# EAGLE design adapter_ADK (EAGLE 6.1)
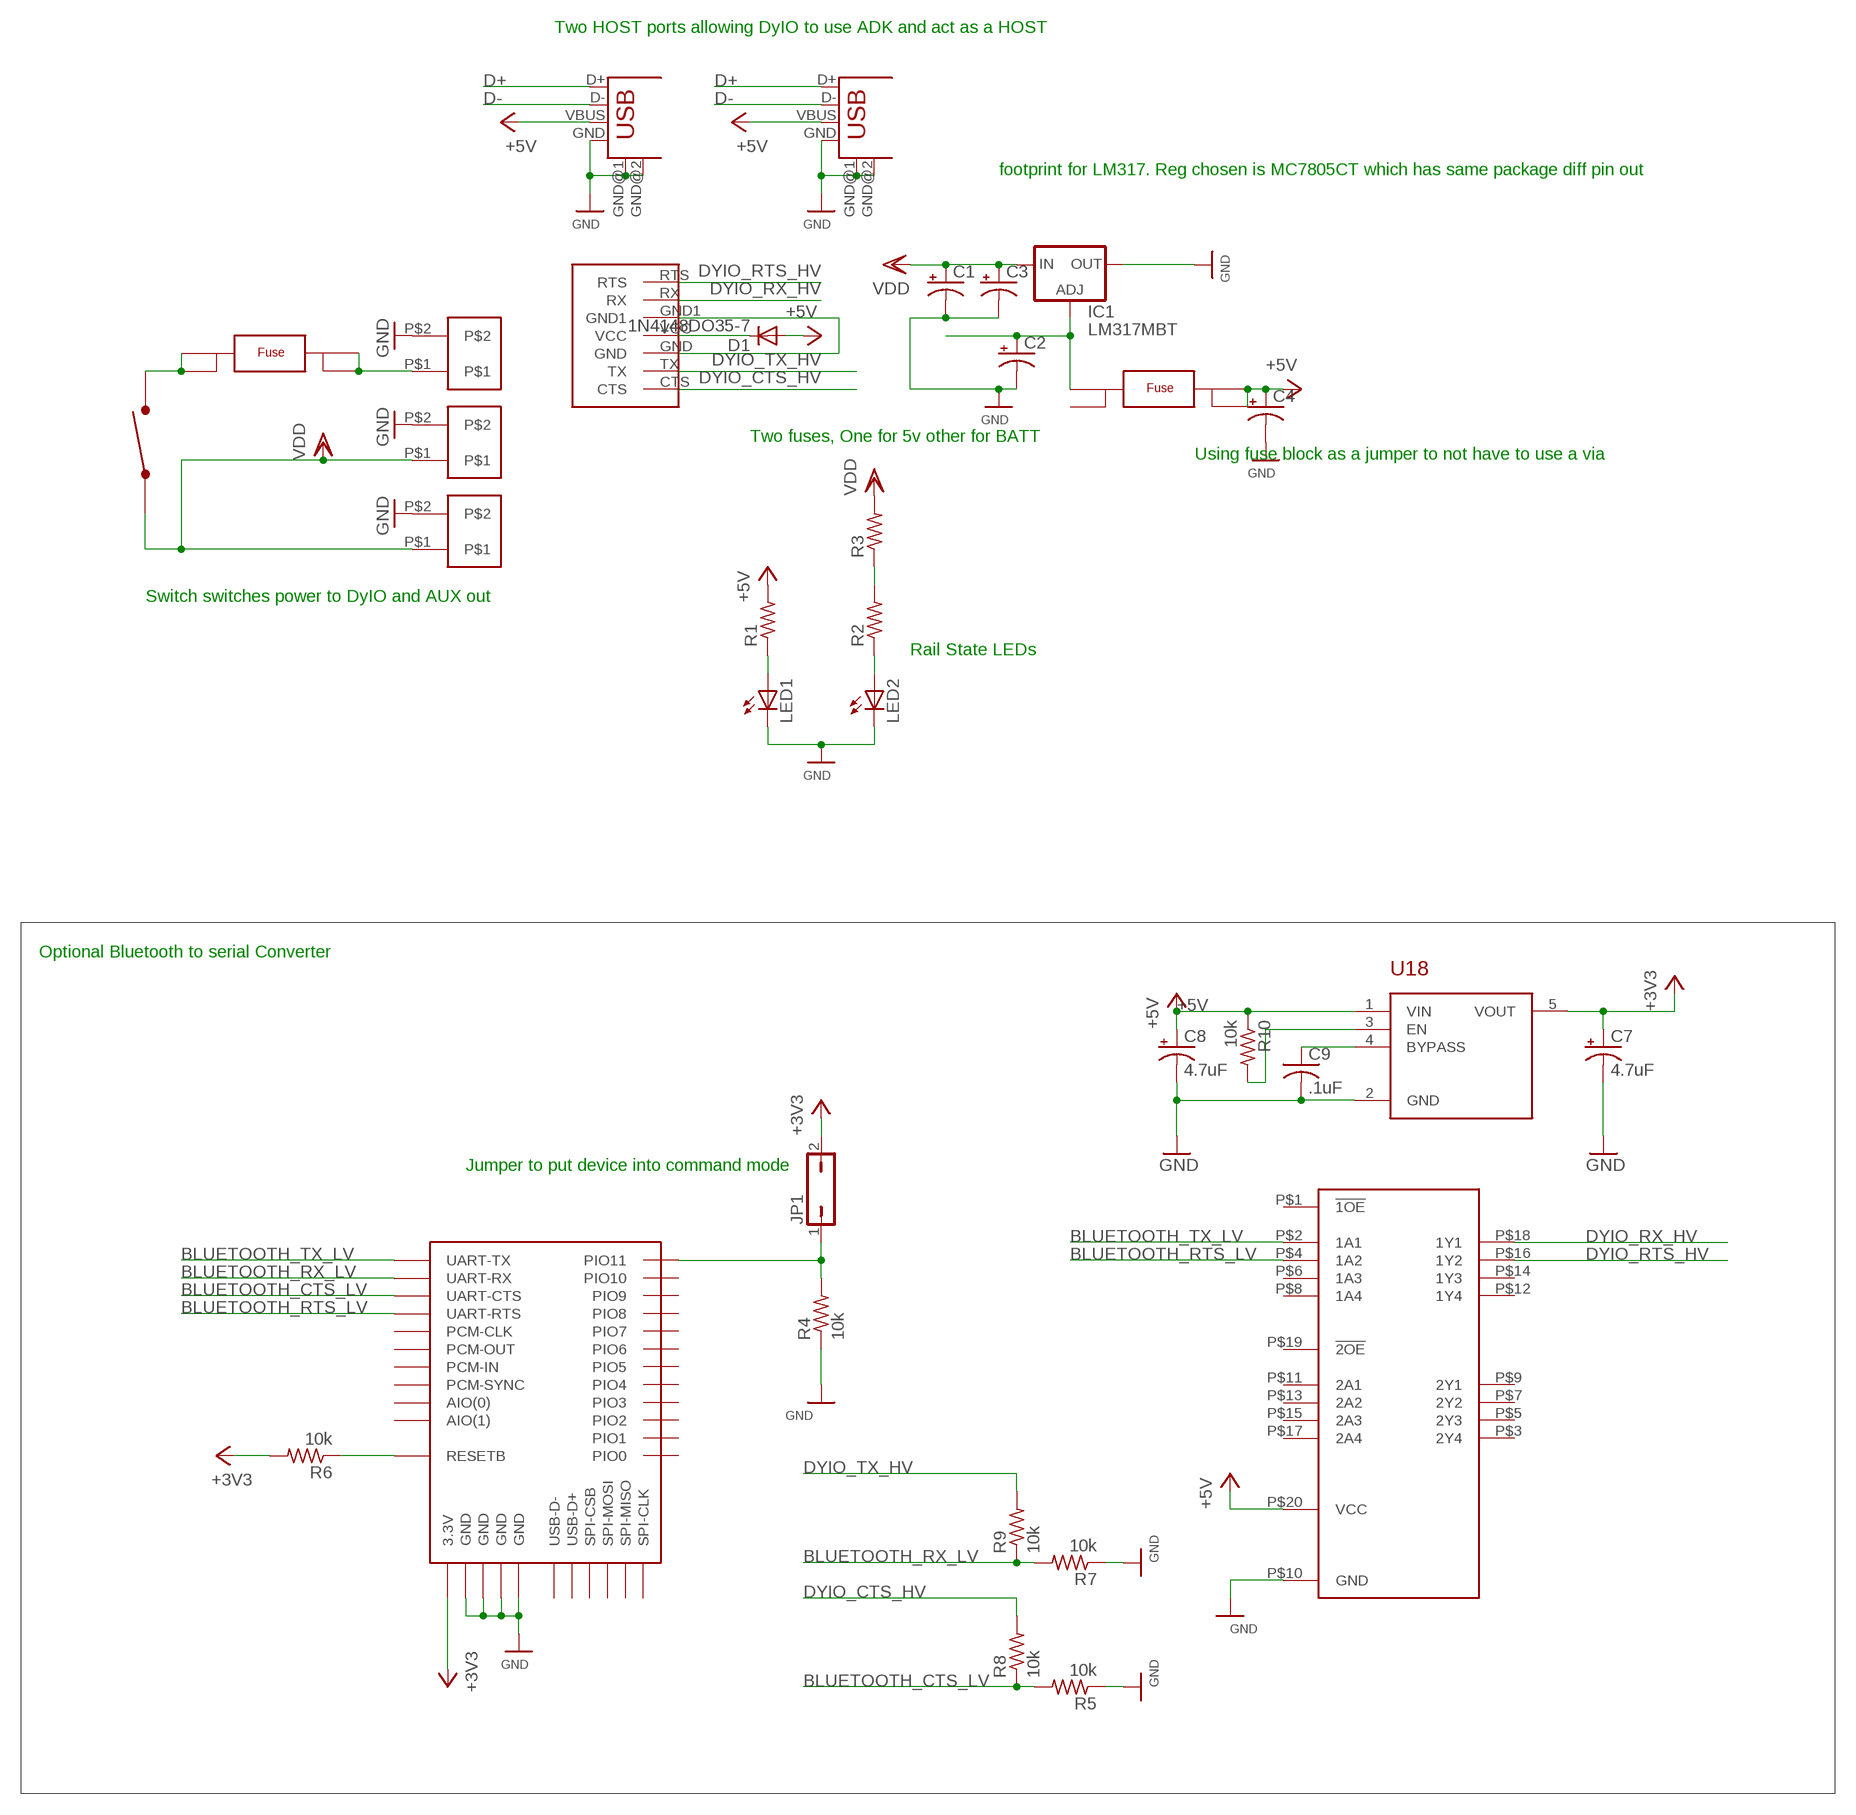
[diagram p0: schematic, sheet 1]

## Parts
C1  CPOL-USE2.5-5  [E2,5-5]
C2  CPOL-USE2.5-5  [E2,5-5]
C3  CPOL-USE2.5-5  [E2,5-5]
C4  CPOL-USE2.5-5  [E2,5-5]
C7  4.7uF  CPOL-USR/2012-12R  [R/2012-12R]
C8  4.7uF  CPOL-USR/2012-12R  [R/2012-12R]
C9  .1uF  C-USC0402  [C0402]
D1  1N4148DO35-7  [DO35-7]
IC1  LM317MBT  [TO220L1]
JP1  JP1Q  [JP1]
LED1  LED5MM  [LED5MM]
LED2  LED5MM  [LED5MM]
R1  R-US_0204/2V  [0204V]
R2  R-US_0204/2V  [0204V]
R3  R-US_0204/2V  [0204V]
R4  10k  R-US_R0603  [R0603]
R5  10k  R-US_R0603  [R0603]
R6  10k  R-US_R0603  [R0603]
R7  10k  R-US_R0603  [R0603]
R8  10k  R-US_R0603  [R0603]
R9  10k  R-US_R0603  [R0603]
R10  10k  R-US_R0402  [R0402]
U18  LDS3985XX33  [SOT23-5]
U$1  FUSE520  [FUSE-520]
U$2  FUSE520  [FUSE-520]
U$3  2P  [2PTH]
U$4  2P  [2PTH]
U$5  SPST  [SW331-ND]
U$6  BTM400_6B  [BTM400_6B]
U$7  SN74ACT24  [R-PDS0-G20]
U$10  WASP7PIN  [WASP7PIN]
U$19  2P  [2PTH]
USB1  USB-A-H  [USB-A-H]
USB2  USB-A-H  [USB-A-H]

## Nets
+3V3: C7.+ JP1.2 R6.2 U18.5(VOUT) U$6.3.3V
+5V: C4.+ C8.+ D1.A R1.2 R10.1 U18.1(VIN) U$2.F2A U$2.F2B U$7.P$20(VCC) USB1.VBUS USB2.VBUS
BLUETOOTH_CTS_LV: R5.2 R8.1 U$6.UART-CTS
BLUETOOTH_RTS_LV: U$6.UART-RTS U$7.P$4(1A2)
BLUETOOTH_RX_LV: R7.2 R9.1 U$6.UART-RX
BLUETOOTH_TX_LV: U$6.UART-TX U$7.P$2(1A1)
CFG: JP1.1 R4.2 U$6.PIO(11)(PIO11)
D+: USB1.D+ USB2.D+
D-: USB1.D- USB2.D-
DYIO_CTS_HV: R8.2 U$10.CTS
DYIO_RTS_HV: U$7.P$16(1Y2) U$10.RTS
DYIO_RX_HV: U$7.P$18(1Y1) U$10.RX
DYIO_TX_HV: R9.2 U$10.TX
GND: C1.- C2.- C3.- C4.- C7.- C8.- C9.2 IC1.2(OUT) LED1.K(C) LED2.K(C) R4.1 R5.1 R7.1 U18.2(GND) U$3.P$2 U$4.P$2 U$6.GND@1(GND) U$6.GND@2(GND) U$6.GND@3(GND) U$6.GND@4(GND) U$7.P$10(GND) U$10.GND U$10.GND1 U$19.P$2 USB1.GND USB1.GND@1(GND) USB1.GND@2(GND) USB2.GND USB2.GND@1(GND) USB2.GND@2(GND)
N$1: U$1.F1A U$1.F1B U$5.SW2
N$2: U$1.F2A U$1.F2B U$3.P$1
N$3: LED1.A R1.1
N$4: C2.+ IC1.1(ADJ) U$2.F1A
N$5: LED2.A R2.1
N$6: R2.2 R3.1
N$7: D1.C U$10.VCC
N$8: R6.1 U$6.RESETB
N$9: R10.2 U18.3(EN)
N$10: C9.1 U18.4(BYPASS)
VDD: C1.+ C3.+ IC1.3(IN) R3.2 U$4.P$1 U$5.SW1 U$19.P$1
Unconnected: U$2.F1B U$6.AIO(0) U$6.AIO(1) U$6.PCM-CLK U$6.PCM-IN U$6.PCM-OUT U$6.PCM-SYNC U$6.PIO(0)(PIO0) U$6.PIO(1)(PIO1) U$6.PIO(2)(PIO2) U$6.PIO(3)(PIO3) U$6.PIO(4)(PIO4) U$6.PIO(5)(PIO5) U$6.PIO(6)(PIO6) U$6.PIO(7)(PIO7) U$6.PIO(8)(PIO8) U$6.PIO(9)(PIO9) U$6.PIO(10)(PIO10) U$6.SPI-CLK U$6.SPI-CSB U$6.SPI-MISO U$6.SPI-MOSI U$6.USB-D+ U$6.USB-D- U$7.P$1(!1OE) U$7.P$3(2Y4) U$7.P$5(2Y3) U$7.P$6(1A3) U$7.P$7(2Y2) U$7.P$8(1A4) U$7.P$9(2Y1) U$7.P$11(2A1) U$7.P$12(1Y4) U$7.P$13(2A2) U$7.P$14(1Y3) U$7.P$15(2A3) U$7.P$17(2A4) U$7.P$19(!2OE)

## Notes on the sheet
- Two HOST ports allowing DyIO to use ADK and act as a HOST
- footprint for LM317. Reg chosen is MC7805CT which has same package diff pin out
- Two fuses, One for 5v other for BATT
- Using fuse block as a jumper to not have to use a via
- Switch switches power to DyIO and AUX out
- Rail State LEDs
- Optional Bluetooth to serial Converter
- Jumper to put device into command mode

## Library data of the parts
C1-C4 C7 C8 = rcl:CPOL-US: POLARIZED CAPACITOR, American symbol
C9 = rcl:C-US: CAPACITOR, American symbol
D1 = diode:1N4148: DIODE high speed (Philips)
IC1 = v-reg:LM317?*: 500 mA Adjustable Output Positive Voltage Regulator Source: http://www.onsemi.co.jp .. LM317M-D.PDF
JP1 = jumper:JP1Q: JUMPER
LED1 LED2 = led:LED: LED OSRAM: - CHIPLED LG R971, LG N971, LY N971, LG Q971, LY Q971, LO R971, LY R971 LH N974, LH R974 LS Q976, LO Q976, LY Q976 LO Q996 - Hyper CHIPLED LW Q18S LB Q993, LB Q99A, LB R99A - SideLED LS A670, LO A670, LY A670, LG A670, LP A670 LB A673, LV A673, LT A673, LW A673 LH A674 LY A675 LS A676, LA A676, LO A676, LY A676, LW A676 LS A679, LY A679, LG A679 - Hyper Micro SIDELED® LS Y876, LA Y876, LO Y876, LY Y876 LT Y87S - SmartLED LW L88C, LW L88S LB L89C, LB L89S, LG L890 LS L89K, LO L89K, LY L89K LS L896, LA L896, LO L896, LY L896 - TOPLED LS T670, LO T670, LY T670, LG T670, LP T670 LSG T670, LSP T670, LSY T670, LOP T670, LYG T670 LG T671, LOG T671, LSG T671 LB T673, LV T673, LT T673, LW T673 LH T674 LS T676, LA T676, LO T676, LY T676, LB T676, LH T676, LSB T676, LW T676 LB T67C, LV T67C, LT T67C, LS T67K, LO T67K, LY T67K, LW E67C LS E67B, LA E67B, LO E67B, LY E67B, LB E67C, LV E67C, LT E67C LW T67C LS T679, LY T679, LG T679 LS T770, LO T770, LY T770, LG T770, LP T770 LB T773, LV T773, LT T773, LW T773 LH T774 LS E675, LA E675, LY E675, LS T675 LS T776, LA T776, LO T776, LY T776, LB T776 LHGB T686 LT T68C, LB T68C - Hyper Mini TOPLED® LB M676 - Mini TOPLED Santana® LG M470 LS M47K, LO M47K, LY M47K Source: http://www.osram.convergy.de LUXEON: - LUMILED® LXK2-PW12-R00, LXK2-PW12-S00, LXK2-PW14-U00, LXK2-PW14-V00 LXK2-PM12-R00, LXK2-PM12-S00, LXK2-PM14-U00 LXK2-PE12-Q00, LXK2-PE12-R00, LXK2-PE12-S00, LXK2-PE14-T00, LXK2-PE14-U00 LXK2-PB12-K00, LXK2-PB12-L00, LXK2-PB12-M00, LXK2-PB14-N00, LXK2-PB14-P00, LXK2-PB14-Q00 LXK2-PR12-L00, LXK2-PR12-M00, LXK2-PR14-Q00, LXK2-PR14-R00 LXK2-PD12-Q00, LXK2-PD12-R00, LXK2-PD12-S00 LXK2-PH12-R00, LXK2-PH12-S00 LXK2-PL12-P00, LXK2-PL12-Q00, LXK2-PL12-R00 Source: www.luxeon.com KINGBRIGHT: KA-3528ASYC Source: www.kingbright.com
R1-R3 R10 = rcl:R-US_: RESISTOR, American symbol
R4-R9 = resistor:R-US_: RESISTOR, American symbol
U18 = LDS3985XX33:LDS3985XX33
U$1 U$2 = fuse:FUSE520
U$3 U$4 U$19 = con_2h_70555-0001:2P
U$5 = SW331-ND:SPST
U$6 = misc:BTM400_6B
U$7 = sn74act24:SN74ACT24
U$10 = wasp7pin:WASP7PIN
USB1 USB2 = con-usb-2:USB: USB Connectors

## Board
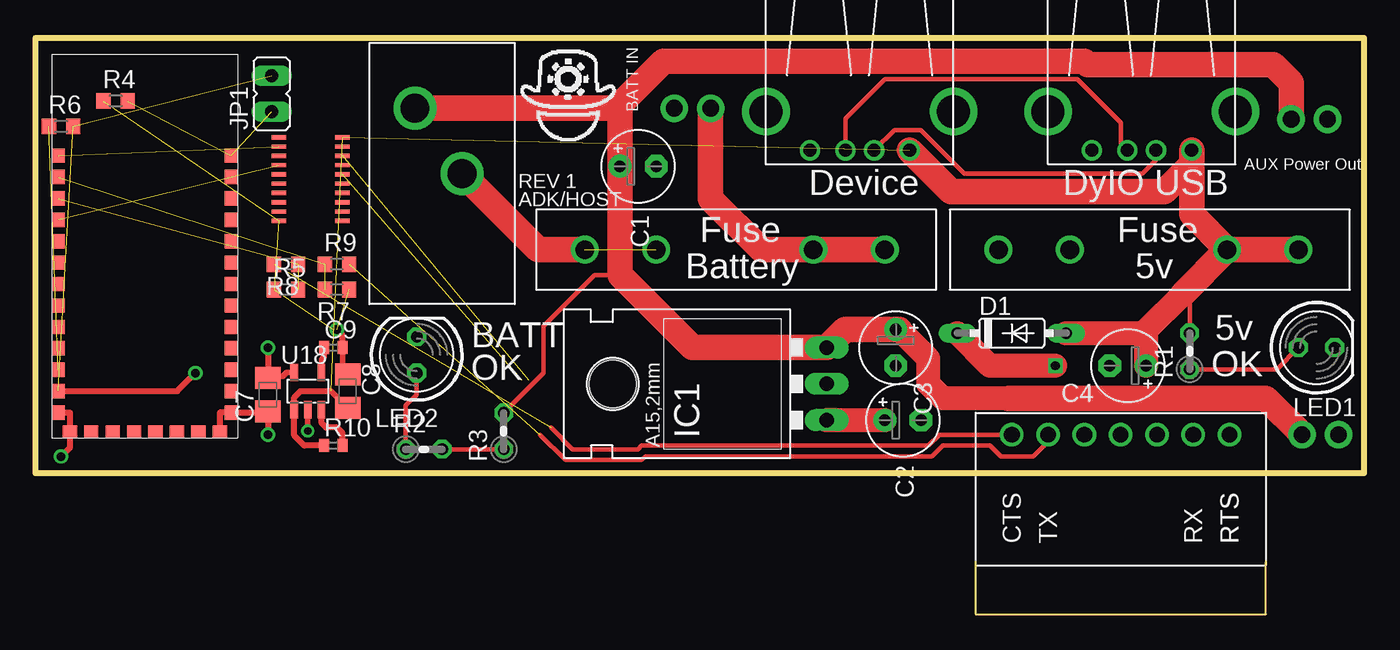
[diagram p1: board, top side]
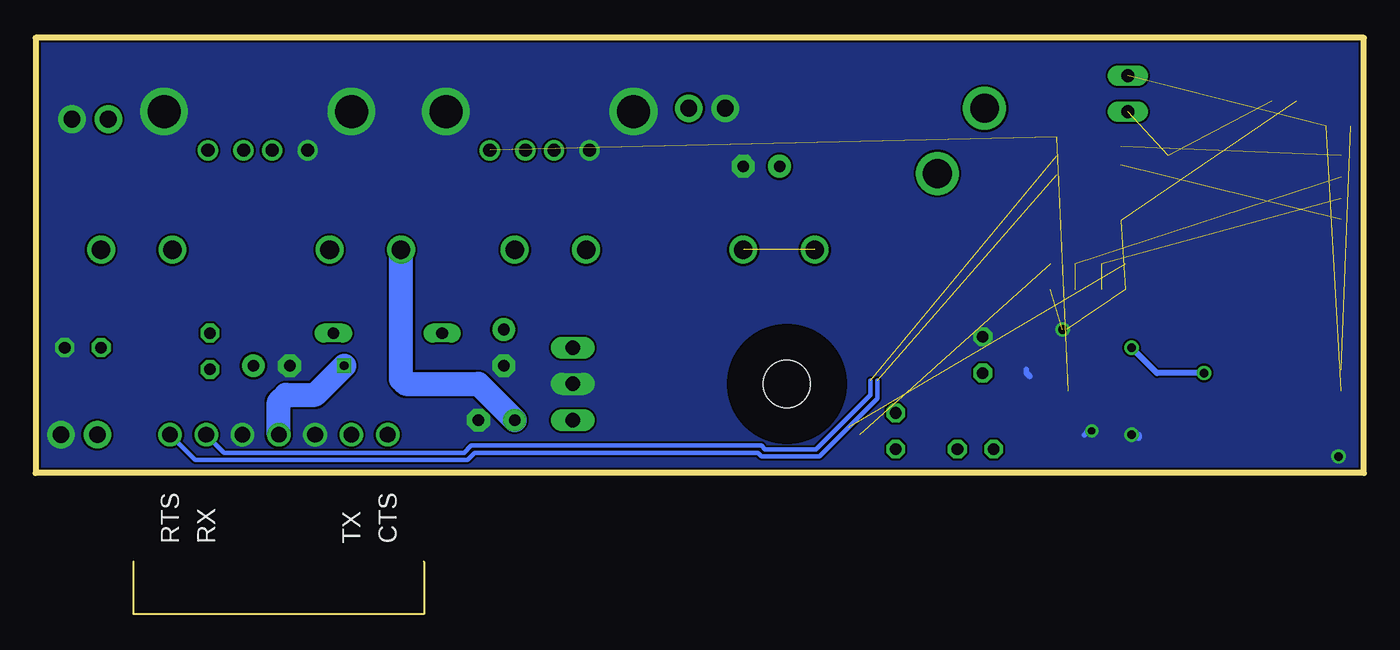
[diagram p2: board, bottom side, seen from below]

Size 92.96 x 30.48 mm. Coordinates in mm from the lower left corner, seen from the top.
Outline: 0,0 92.96,0 92.96,30.48 0,30.48 0,0
Copper layers (1*16): Top 0.035mm / dielectric 1.5mm / Bottom 0.035mm
Design rules: minimum track width 6mil, minimum drill 15mil, track to track 6mil, track to pad 6mil, pad to pad 6mil, via to via 6mil, smd to smd 6mil, copper to edge 6mil, drill to drill 6mil, minimum pad ring 10mil, minimum via ring 8mil, stop-mask expansion 4mil, vias tented up to drill 25mil, thermal gap 10mil

### Footprints (pad centres in the part's own frame; a part is rotated, then mirrored left to right if it is on the bottom)
E2,5-5 = drill 0.813 pad 1.6: + -1.27,0 | drill 0.813 pad 1.6 octagon: - 1.27,0
R/2012-12R = smd 1.55 x 1.8: + 1.175,0; - -1.175,0
C0402 = smd 0.7 x 0.9: 1 -0.65,0; 2 0.65,0
DO35-7 = drill 0.813 long: A 3.81,0; C -3.81,0
TO220L1 = drill 1.016 long: 1 -2.54,-3.81; 2 0,-3.81; 3 2.54,-3.81 | hole 3.302: 0,11.176
JP1 = drill 0.914 long: 1 0,-1.27; 2 0,1.27
LED5MM = drill 0.813 octagon: A -1.27,0; K 1.27,0
0204V = drill 0.813 octagon: 1 -1.27,0; 2 1.27,0
R0603 = smd 1 x 1.1: 1 -0.85,0; 2 0.85,0
R0402 = smd 0.7 x 0.9: 1 -0.65,0; 2 0.65,0
SOT23-5 = smd 0.55 x 1.2: 1 -0.95,-1.3; 2 0,-1.3; 3 0.95,-1.3; 4 0.95,1.3; 5 -0.95,1.3
FUSE-520 = drill 1.3: F1A -5,0; F1B 0,0; F2A 11,0; F2B 16,0
2PTH = drill 1.168 pad 1.93: P$1 -2.54,0; P$2 0,0
SW331-ND = drill 2.007: SW1 -4.572,-1.905; SW2 0,1.397
BTM400_6B = smd 0.9 x 1: 3.3V -6.05,-10.16; AIO(0) -6.05,-5.66; AIO(1) -6.05,-7.16; GND@1 -6.05,-11.66; GND@4 6.05,-11.66; PCM-CLK -6.05,0.34; PCM-IN -6.05,-2.66; PCM-OUT -6.05,-1.16; PCM-SYNC -6.05,-4.16; PIO(0) 6.05,-10.16; PIO(1) 6.05,-8.66; PIO(2) 6.05,-7.16; PIO(3) 6.05,-5.66; PIO(4) 6.05,-4.16; PIO(5) 6.05,-2.66; PIO(6) 6.05,-1.16; PIO(7) 6.05,0.34; PIO(8) 6.05,1.84; PIO(9) 6.05,3.34; PIO(10) 6.05,4.84; PIO(11) 6.05,6.34; RESETB -6.05,-8.66; UART-CTS -6.05,3.34; UART-RTS -6.05,1.84; UART-RX -6.05,4.84; UART-TX -6.05,6.34 | smd 1 x 0.9: GND@2 -5.23,-13; GND@3 5.27,-13; SPI-CLK 2.27,-13; SPI-CSB -2.23,-13; SPI-MISO 0.77,-13; SPI-MOSI -0.73,-13; USB-D+ 3.77,-13; USB-D- -3.73,-13
R-PDS0-G20 = smd 0.3 x 1: P$1 0,0; P$2 0.65,0; P$3 1.3,0; P$4 1.95,0; P$5 2.6,0; P$6 3.25,0; P$7 3.9,0; P$8 4.55,0; P$9 5.2,0; P$10 5.85,0; P$11 5.85,4.45; P$12 5.2,4.45; P$13 4.55,4.45; P$14 3.9,4.45; P$15 3.25,4.45; P$16 2.6,4.45; P$17 1.95,4.45; P$18 1.3,4.45; P$19 0.65,4.45; P$20 0,4.45
WASP7PIN = drill 1.1: CTS 0,0; GND 5.08,0; GND1 10.16,0; RTS 15.24,0; RX 12.7,0; TX 2.54,0; VCC 7.62,0
USB-A-H = drill 0.914: D+ 2.718,-1.003; D- 2.718,1.003; GND 2.718,-3.493; VBUS 2.718,3.493 | drill 2.311: GND@1 0,6.566; GND@2 0,-6.566

### Placement (x,y rotation side)
C1  42.16,21.49 0 top
C2  60.71,3.71 0 top
C3  60.2,8.79 270 top
C4  76.45,7.52 180 top
C7  16.26,5.49 90 top
C8  21.84,5.74 270 top
C9  20.83,8.79 0 top
D1  68.33,9.8 0 top
IC1  51.56,6.25 90 top
JP1  16.51,26.57 0 top
LED1  89.66,8.79 0 top
LED2  26.67,8.28 90 top
R1  80.77,8.53 90 top
R2  27.18,1.68 0 top
R3  32.77,2.95 90 top
R4  5.59,26.06 0 top
R5  17.53,12.85 0 top
R6  1.78,24.28 0 top
R7  21.08,12.85 180 top
R8  17.53,14.63 180 top
R9  21.08,14.63 0 top
R10  20.83,1.93 0 top
U18  19.05,5.74 0 top
U$1  43.43,15.65 0 top
U$2  72.39,15.65 0 top
U$3  44.7,25.55 180 top
U$4  90.42,24.79 0 top
U$5  28.45,20.98 270 top
U$6  7.62,15.9 0 top
U$7  17.02,23.52 270 top
U$10  68.33,2.69 0 top
U$19  91.19,2.69 0 top
USB1  57.68,25.32 270 top
USB2  77.42,25.32 270 top

### Tracks (layer width: path | path; a pad name or v marks a point on that pad's centre or on a via)
+3V3  (via drill 0.6)  (2 unrouted)
  Top 0.381: U18.5 17.56,7.04 17.27,6.76 16.35,6.76 C7.+
  Top 0.406: U$6.3.3V 9.91,5.74 v11.18,7.01 | v16.26,8.79 C7.+
  Bottom 0.406: v11.18,7.01 14.48,7.01 v16.26,8.79
+5V  (2 unrouted)
  Top 0.305: R1.2 80.77,12.09 80.3,12.56
  Top 0.406: R10.1 18.8,1.93 18.1,2.63 U18.1 18.1,5.3 18.54,5.74 20.67,5.74 C8.+
  Top 1.676: 80.3,12.56 77.72,9.98 | 77.72,9.98 C4.+ | D1.A 77.55,9.8 77.72,9.98
  Top 1.778: 80.3,12.56 U$2.F2A | USB1.VBUS 64.07,19.71 78.99,19.71 80.91,21.63 USB2.VBUS 80.91,18.12 U$2.F2A | U$2.F2A U$2.F2B
BLUETOOTH_CTS_LV  (2 unrouted)
BLUETOOTH_RTS_LV  (1 unrouted)
BLUETOOTH_RX_LV  (2 unrouted)
BLUETOOTH_TX_LV  (1 unrouted)
CFG  (2 unrouted)
D+
  Top 0.305: USB1.D+ 56.68,24.83 59.44,27.58 72.9,27.58 75.95,24.54 75.95,23.08 USB2.D+
D-
  Top 0.305: USB2.D- 78.42,21.93 77.47,20.98 65.02,20.98 61.98,24.03 60.11,24.03 USB1.D-
DYIO_CTS_HV  (1 unrouted)
  Top 0.305: U$10.CTS 63.25,2.69 62.48,1.93 42.42,1.93 42.16,1.68 37.59,1.68 36.07,3.2
DYIO_RTS_HV  (1 unrouted)
  Bottom 0.305: U$10.RTS 81.79,0.91 62.74,0.91 62.23,1.42 42.42,1.42 42.16,1.17 38.1,1.17 34.04,5.23 34.04,6.5
DYIO_RX_HV  (1 unrouted)
  Bottom 0.305: U$10.RX 79.76,1.42 62.99,1.42 62.48,1.93 42.16,1.93 41.91,1.68 38.35,1.68 34.54,5.49 34.54,6.5
DYIO_TX_HV  (1 unrouted)
  Top 0.305: U$10.TX 70.87,2.18 69.85,1.17 67.56,1.17 66.8,1.93 63.5,1.93 62.74,1.17 42.67,1.17 42.42,0.91 37.08,0.91 35.31,2.69
GND  (via drill 0.5, 0.6)  (4 unrouted)
  Top 0.381: U18.2 v19.05,2.95 | C9.2 21.48,7.28 C8.- 22,6.76
  Top 0.406: U$6.GND@3 12.89,4.24 U$6.GND@4 16.26,4.24 C7.- v16.26,2.69 | U$6.GND@1 2.39,4.24 U$6.GND@2 2.39,1.78 v1.78,1.17 | C9.2 21.48,9.66 v21.08,10.06
  Bottom 0.381: v19.05,2.95 19.3,2.95 19.56,2.69 | 23.37,6.76 23.62,7.01 23.62,7.26
  Bottom 0.406: v16.26,2.69 15.75,2.69 15.75,2.44 | v1.78,1.17 1.52,1.17 | v21.08,10.06 20.83,10.06
  pour Bottom (no thermals): 0,30.38 -3.05,-2.9 95,-1.37 95,32.66
N$1  (1 unrouted)
  Top 1.778: U$1.F1A 35.18,15.65 U$5.SW2
N$2
  Top 1.778: U$3.P$1 47.24,19.2 50.8,15.65 U$1.F2A U$1.F2B
N$3
  Top 0.305: R1.1 86.87,7.26 LED1.A
N$4
  Top 1.676: IC1.1 C2.+
  Bottom 1.676: U$2.F1A 67.39,6.58 67.06,6.25 61.98,6.25 C2.+
N$5
  Top 0.305: LED2.A 26.67,5.49 25.91,4.72 R2.1
N$6
  Top 0.305: R2.2 R3.1
N$7  (via drill 0.6)
  Top 1.676: v71.37,7.52 66.8,7.52 D1.C
  Bottom 1.676: U$10.VCC 75.95,4.98 75.44,5.49 73.41,5.49 v71.37,7.52
N$8  (1 unrouted)
N$9
  Top 0.406: R10.2 21.48,2.8 21.08,3.2 20.32,3.2 20,3.52 U18.3
N$10
  Top 0.381: U18.4 20,7.96 20.18,8.14 C9.1
VDD
  Top 0.305: 40.89,13.87 39.12,13.87 35.56,10.31 35.56,7.01 R3.2
  Top 1.676: 68.07,5.23 63.5,5.23 62.48,6.25 62.48,8.03 60.45,10.06
  Top 1.778: 60.45,10.06 C3.+ 56.64,10.06 IC1.3 45.97,8.79 40.89,13.87 C1.+ 40.89,25.55 | 68.07,5.23 86.11,5.23 U$19.P$1 | U$4.P$1 87.88,27.33 86.61,28.6 73.66,28.6 73.41,28.85 43.94,28.85 40.89,25.81 40.89,25.55 | 40.89,25.55 U$5.SW1

### Text on the board
tNames: BATT IN | AUX Power Out | REV 1 | ADK/HOST | Device | DyIO USB | Fuse | Fuse | Battery | 5v | BATT | 5v | OK | OK